# EAGLE design H_BRIDGE_40A (EAGLE 5.06)
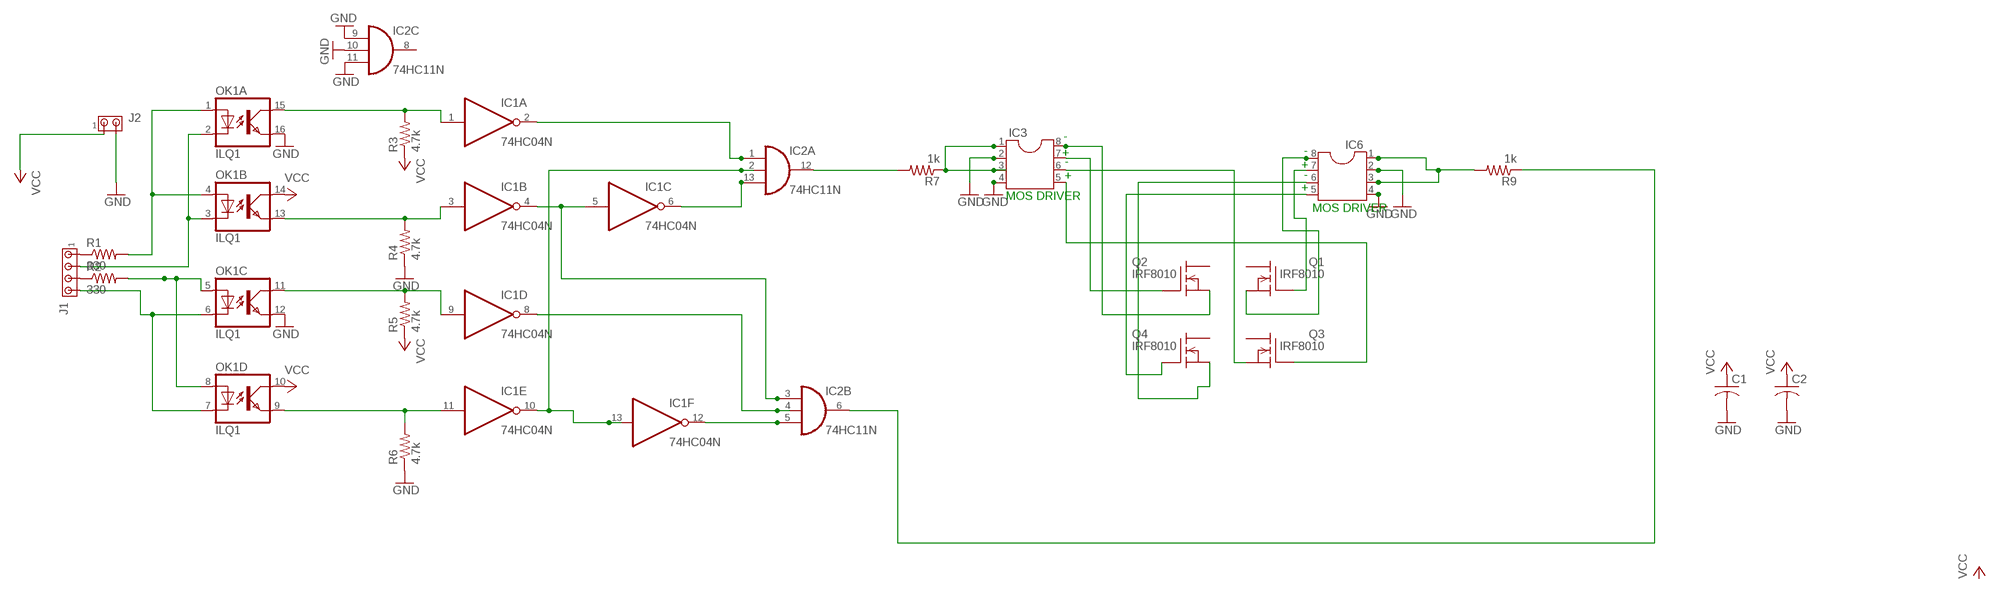
[diagram p0: schematic, sheet 1]

## Parts
C1  C-US025-030X050  [C025-030X050]
C2  C-US025-030X050  [C025-030X050]
IC1  74HC04N  [DIL14]
IC2  74HC11N  [DIL14]
IC3  DIL8  [DIL08]
IC6  DIL8  [DIL08]
J1  MTA04-100  [10X04MTA]
J2  MTA02-100  [10X02MTA]
OK1  ILQ1  [DIL16]
Q1  IRF8010  IRF840  [TO220]
Q2  IRF8010  IRF840  [TO220]
Q3  IRF8010  IRF840  [TO220]
Q4  IRF8010  IRF840  [TO220]
R1  330  R-US_0204/7  [0204/7]
R2  330  R-US_0204/7  [0204/7]
R3  4.7k  R-US_0204/7  [0204/7]
R4  4.7k  R-US_0204/7  [0204/7]
R5  4.7k  R-US_0204/7  [0204/7]
R6  4.7k  R-US_0204/7  [0204/7]
R7  1k  R-US_0204/7  [0204/7]
R9  1k  R-US_0204/7  [0204/7]

## Nets
GND: C1.2 C2.2 IC2.9(C:I0) IC2.10(C:I1) IC2.11(C:I2) IC3.2 IC3.4 IC6.2 IC6.4 J2.2 OK1.12(C:EMIT) OK1.16(A:EMIT) R4.1 R6.1
N$1: J1.1 R1.1
N$2: J1.3 R2.1
N$3: OK1.1(A:A) OK1.4(B:A) R1.2
N$4: J1.2 OK1.2(A:C) OK1.3(B:C)
N$5: OK1.5(C:A) OK1.8(D:A) R2.2
N$6: J1.4 OK1.6(C:C) OK1.7(D:C)
N$7: IC1.1(A:I) OK1.15(A:COL) R3.2
N$8: IC1.3(B:I) OK1.13(B:EMIT) R4.2
N$9: IC1.9(D:I) OK1.11(C:COL) R5.2
N$10: IC1.11(E:I) OK1.9(D:EMIT) R6.2
N$11: IC1.4(B:O) IC1.5(C:I) IC2.3(B:I0)
N$12: IC1.10(E:O) IC1.13(F:I) IC2.2(A:I1)
N$13: IC1.2(A:O) IC2.1(A:I0)
N$14: IC1.6(C:O) IC2.13(A:I2)
N$15: IC1.8(D:O) IC2.4(B:I1)
N$16: IC1.12(F:O) IC2.5(B:I2)
N$17: IC2.12(A:O) R7.2
N$18: IC2.6(B:O) R9.1
N$19: IC3.1 IC3.3 R7.1
N$21: IC6.1 IC6.3 R9.2
N$22: IC3.6 Q3.3(S)
N$23: IC6.5 Q4.1(G)
N$24: IC3.5 Q3.1(G)
N$26: IC3.7 Q2.1(G)
N$35: IC6.6 Q4.3(S)
N$36: IC6.8 Q1.3(S)
N$40: IC3.8 Q2.3(S)
N$42: IC6.7 Q1.1(G)
VCC: C1.1 C2.1 J2.1 OK1.10(D:COL) OK1.14(B:COL) R3.1 R5.1
Unconnected: IC2.8(C:O) Q1.2(D) Q2.2(D) Q3.2(D) Q4.2(D)

## Notes on the sheet
- -
- + | -
- -
- +
- + | -
- +
- MOS DRIVER
- MOS DRIVER

## Power pins joined to a net without a drawn wire
GND: IC1.7(P:GND) IC2.7(P:GND)
VCC: IC1.14(P:VCC) IC2.14(P:VCC)

## Library data of the parts
C1 C2 = rcl:C-US: CAPACITOR, American symbol
IC1 = 74xx-eu:74*04: Hex INVERTER
IC2 = 74xx-eu:74*11: Triple 3-input AND gate
IC3 IC6 = ic-package:DIL8: Dual In Line / Socket
J1 = con-amp:MTA04-100: AMP connector
J2 = con-amp:MTA02-100: AMP connector
OK1 = optocoupler:ILQ1: SIEMENS OPTO COUPLER
Q1-Q4 = transistor-fet:IRF840: N-Channel Enhancement MOSFET (HEXFET); 500V; 8A; 0,85Ohm
R1-R7 R9 = rcl:R-US_: RESISTOR, American symbol

## Board
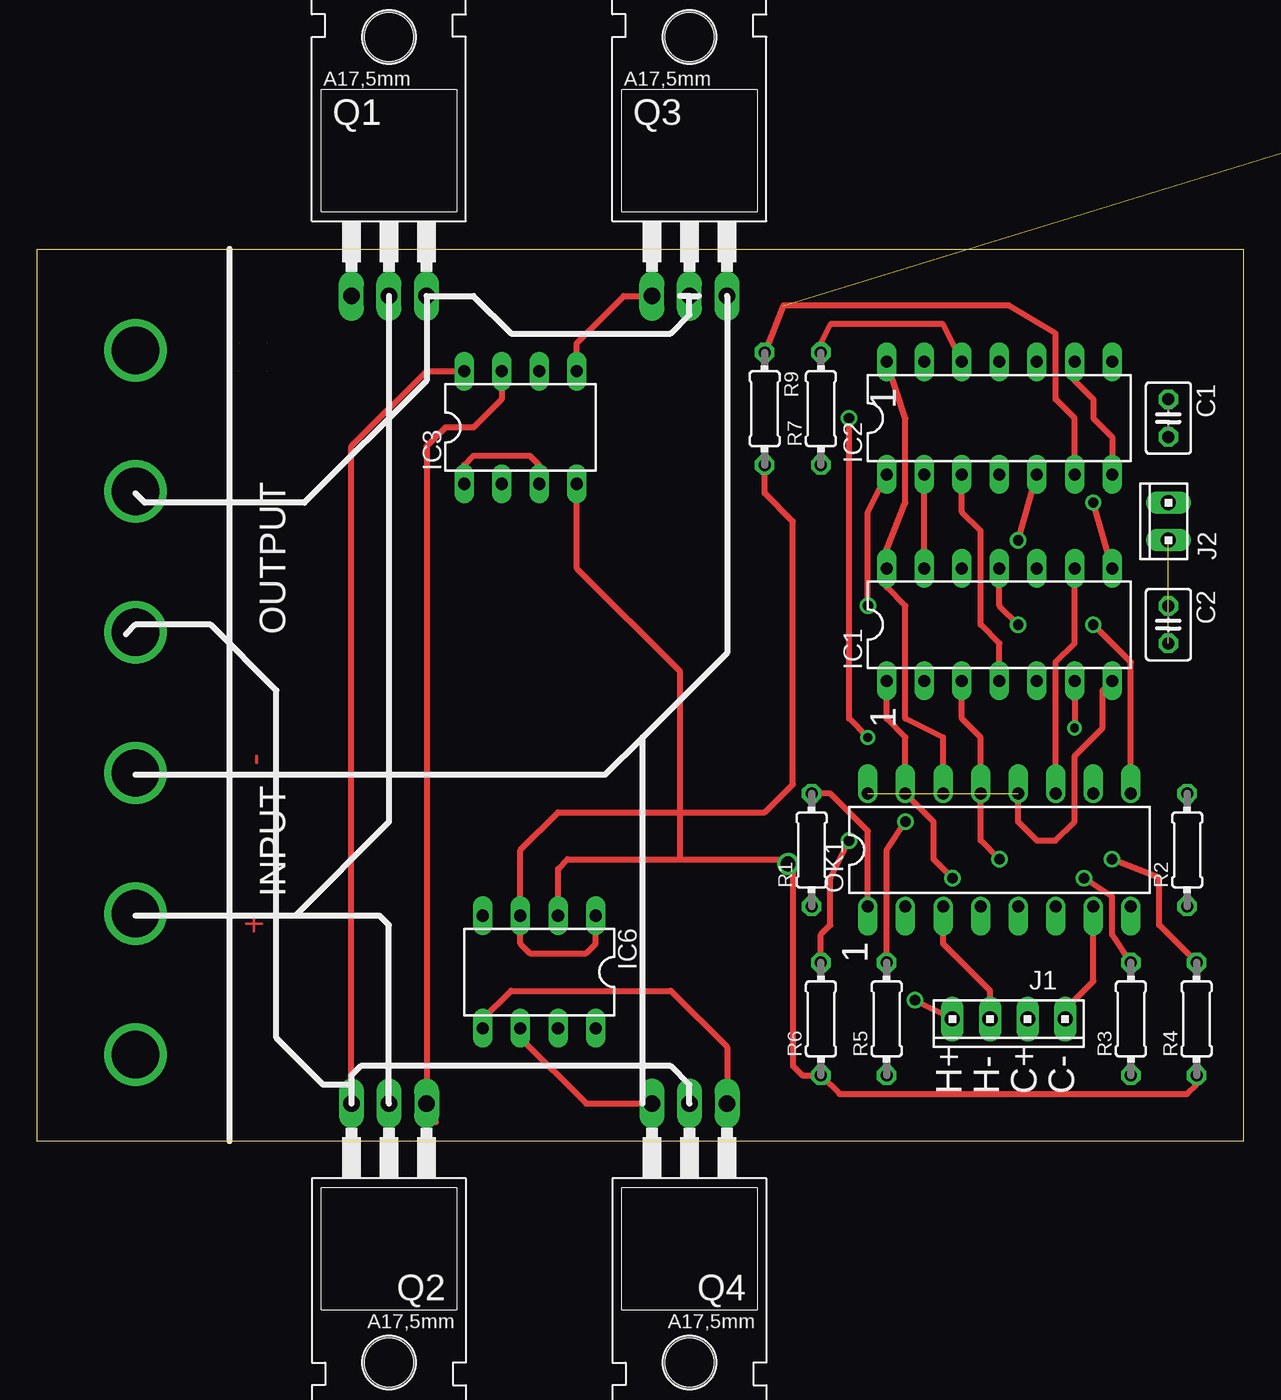
[diagram p1: board, top side]
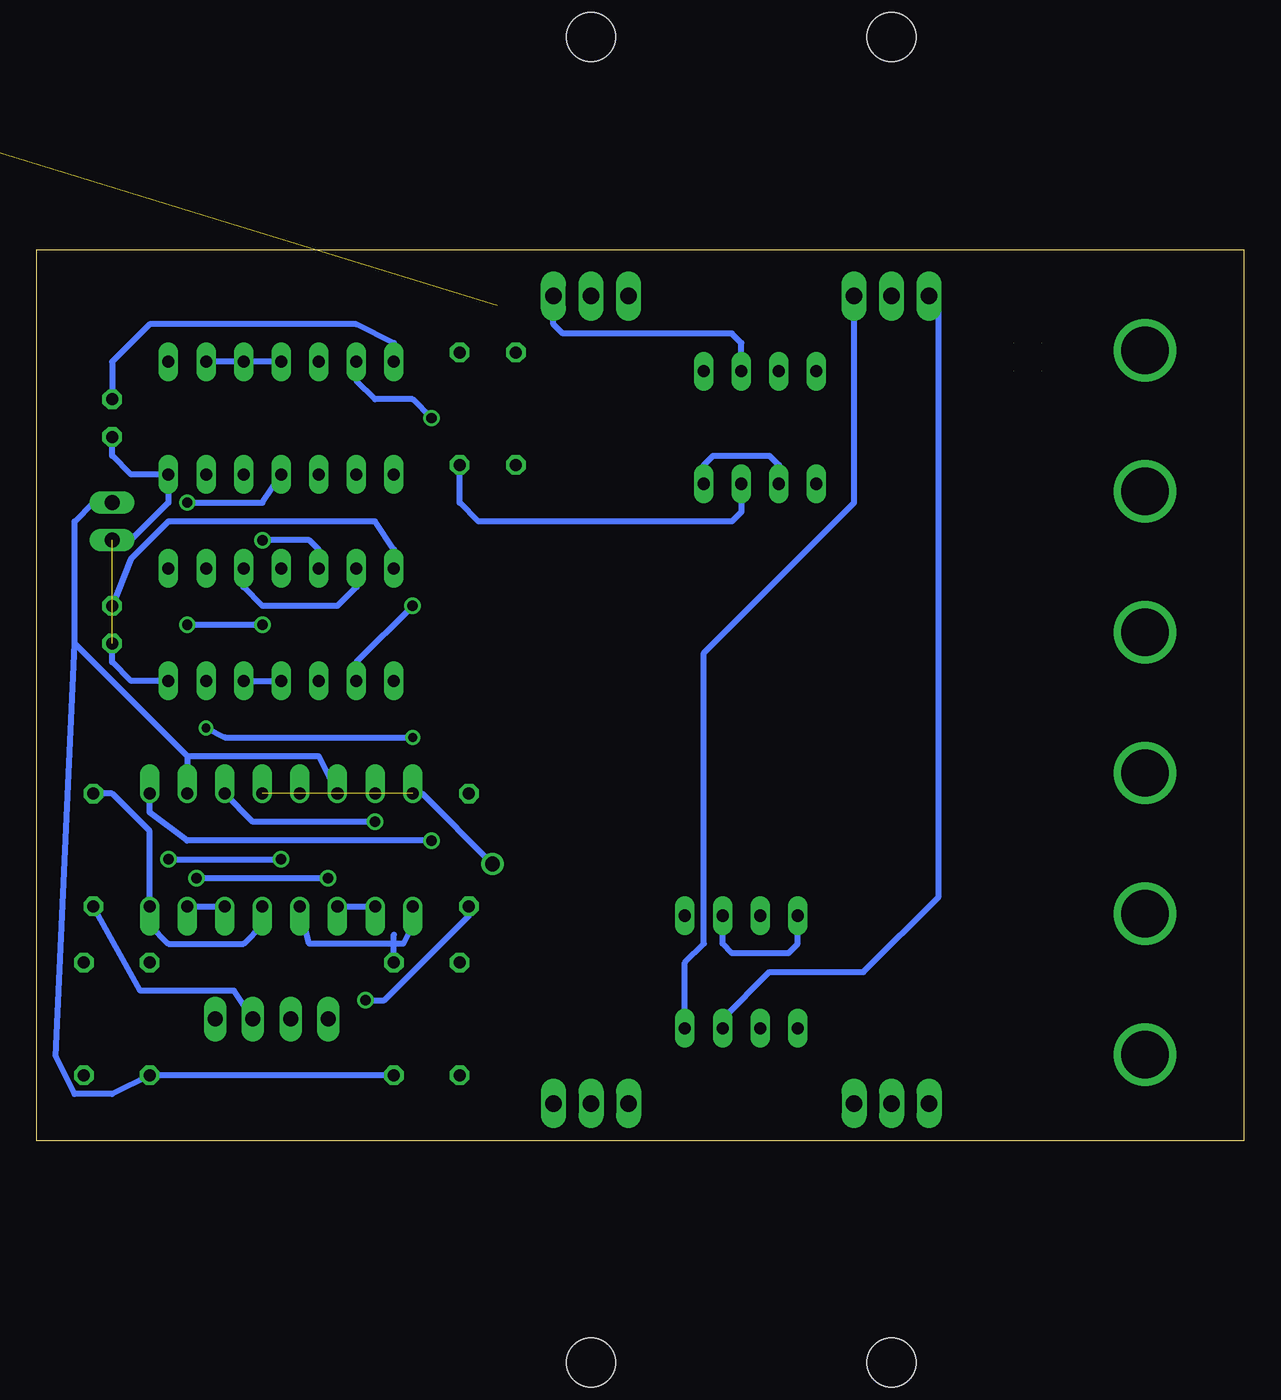
[diagram p2: board, bottom side, seen from below]

Size 81.59 x 60.3 mm. Coordinates in mm from the lower left corner, seen from the top.
Outline: 81.59,0 81.59,60.3 0,60.3 0,0 81.59,0
Copper layers (1*16): Top 0.035mm / dielectric 1.5mm / Bottom 0.035mm
Design rules "default": minimum track width 10mil, minimum drill 24mil, track to track 8mil, track to pad 8mil, pad to pad 8mil, via to via 8mil, smd to smd 8mil, copper to edge 40mil, drill to drill 8mil, minimum pad ring 10mil, minimum via ring 8mil, stop-mask expansion 4mil, vias tented up to drill 0mil, thermal gap 10mil

### Footprints (pad centres in the part's own frame; a part is rotated, then mirrored left to right if it is on the bottom)
C025-030X050 = drill 0.813 octagon: 1 -1.27,0; 2 1.27,0
DIL14 = drill 0.813 long: 1 -7.62,-3.81; 2 -5.08,-3.81; 3 -2.54,-3.81; 4 0,-3.81; 5 2.54,-3.81; 6 5.08,-3.81; 7 7.62,-3.81; 8 7.62,3.81; 9 5.08,3.81; 10 2.54,3.81; 11 0,3.81; 12 -2.54,3.81; 13 -5.08,3.81; 14 -7.62,3.81
DIL08 = drill 0.813 long: 1 -3.81,-3.81; 2 -1.27,-3.81; 3 1.27,-3.81; 4 3.81,-3.81; 5 3.81,3.81; 6 1.27,3.81; 7 -1.27,3.81; 8 -3.81,3.81
10X04MTA = drill 1.016 long: 1 3.81,0; 2 1.27,0; 3 -1.27,0; 4 -3.81,0
10X02MTA = drill 1.016 long: 1 1.27,0; 2 -1.27,0
DIL16 = drill 0.813 offset: 1 -8.89,-3.81; 2 -6.35,-3.81; 3 -3.81,-3.81; 4 -1.27,-3.81; 5 1.27,-3.81; 6 3.81,-3.81; 7 6.35,-3.81; 8 8.89,-3.81; 9 8.89,3.81; 10 6.35,3.81; 11 3.81,3.81; 12 1.27,3.81; 13 -1.27,3.81; 14 -3.81,3.81; 15 -6.35,3.81; 16 -8.89,3.81
TO220 = drill 1.118 long: 1 -2.54,-6.35; 2 0,-6.35; 3 2.54,-6.35 | hole 3.302: 0,11.176
0204/7 = drill 0.813 octagon: 1 -3.81,0; 2 3.81,0

### Placement (x,y rotation side)
C1  76.51,48.9 270 top
C2  76.51,34.92 270 top
IC1  65.08,34.92 0 top
IC2  65.08,48.9 0 top
IC3  32.69,48.26 0 top
IC6  33.96,11.43 180 top
J1  65.71,8.26 180 top
J2  76.51,41.91 90 top
OK1  65.08,19.68 0 top
Q1  23.8,63.5 0 top
Q2  23.8,-3.81 180 top
Q3  44.12,63.5 0 top
Q4  44.12,-3.81 180 top
R1  52.38,19.68 90 top
R2  77.78,19.68 90 top
R3  73.97,8.26 90 top
R4  78.41,8.26 90 top
R5  57.45,8.26 90 top
R6  53.01,8.26 90 top
R7  53.01,49.53 90 top
R9  49.2,49.53 270 top

### Tracks (layer width: path | path; a pad name or v marks a point on that pad's centre or on a via)
GND  (via drill 1)  (2 unrouted)
  Top 0.406: R4.1 78.41,3.81 77.78,3.17 54.28,3.17 R6.1 51.74,4.45 51.1,5.08 51.1,18.41 v50.79,18.73 50.47,19.05 43.48,19.05 | IC2.7 72.7,47.62 71.43,48.9 71.43,50.16 70.16,51.44 IC2.9 70.33,52.88 | OK1.12 66.35,21.59 67.62,20.32 68.89,20.32 70.16,21.59 70.16,26.04 72.06,27.94 72.06,30.48 IC1.7 | IC6.2 35.23,18.41 35.87,19.05 43.48,19.05 | IC3.4 36.5,38.73 43.48,31.75 43.48,19.05
  Bottom 0.406: IC2.9 IC2.10 IC2.11 | C2.2 76.51,32.38 75.24,31.11 IC1.7 | C1.2 76.51,46.35 75.24,45.09 IC2.7 72.7,43.18 75.24,40.64 J2.2 | v50.79,18.73 55.55,23.5 OK1.16 56.19,24.13 | IC6.2 35.23,13.34 34.59,12.7 30.79,12.7 30.15,13.34 IC6.4 | IC3.2 31.42,45.72 32.05,46.35 35.87,46.35 36.5,45.72 IC3.4
N$1  (via drill 0.7)
  Top 0.406: J1.1 v59.36,9.53
  Bottom 0.406: v59.36,9.53 58.09,9.53 52.38,15.24 R1.1
N$2
  Bottom 0.406: J1.3 68.25,10.16 74.6,10.16 R2.1
N$3
  Top 0.406: R1.2 53.65,23.5 56.19,20.95 OK1.1
  Bottom 0.406: OK1.1 56.19,14.61 56.82,13.34 63.17,13.34 OK1.4
N$4
  Top 0.406: J1.2 64.44,10.16 61.27,13.34 OK1.3
  Bottom 0.406: OK1.3 OK1.2
N$5
  Bottom 0.406: R2.2 76.51,23.5 73.97,20.95 OK1.8 73.97,14.61 72.7,13.34 67.62,13.34 66.35,14.61 OK1.5
N$6
  Top 0.406: J1.4 69.52,8.89 71.43,10.79 OK1.7
  Bottom 0.406: OK1.7 OK1.6
N$7  (via drill 0.7)
  Top 0.406: R3.2 72.7,13.97 72.7,16.51 v70.79,17.78 | v61.9,17.78 60.63,19.05 60.63,21.59 OK1.15 58.73,27.3 57.45,28.57 IC1.1
  Bottom 0.406: v70.79,17.78 v61.9,17.78
N$8  (via drill 0.7)
  Top 0.406: R4.2 75.87,14.61 75.87,17.78 v72.7,19.05 | v65.08,19.05 63.8,20.32 OK1.13 63.8,27.3 62.53,28.57 IC1.3
  Bottom 0.406: v72.7,19.05 v65.08,19.05
N$9  (via drill 0.7)  (1 unrouted)
  Top 0.406: R5.2 57.45,13.97 57.45,19.68 v58.73,21.59 | 68.89,24.77 OK1.11 68.89,32.38 70.16,33.66 IC1.9
  Bottom 0.406: v58.73,21.59 66.98,21.59 OK1.11 | R5.2 57.45,13.97
N$10  (via drill 0.7)
  Top 0.406: R6.2 53.01,13.97 53.65,14.61 53.65,17.78 v54.91,20.32 | 73.97,24.77 OK1.9 73.97,32.38 v71.43,34.92 | v66.35,34.92 65.08,36.2 IC1.11
  Bottom 0.406: v54.91,20.32 71.43,20.32 73.97,22.23 OK1.9 | v71.43,34.92 v66.35,34.92
N$11
  Top 0.406: IC1.4 65.08,33.66 63.8,34.92 63.8,41.27 62.53,42.55 IC2.3
  Bottom 0.406: IC1.5 IC1.4
N$12
  Top 0.406: IC1.13 IC2.2
  Bottom 0.406: IC1.13 59.99,37.47 61.27,36.2 66.35,36.2 67.62,37.47 IC1.10
N$13  (via drill 0.7)
  Top 0.406: v56.19,36.2 56.19,42.55 IC2.1
  Bottom 0.406: IC1.2 59.99,32.38 v56.19,36.2
N$14  (via drill 0.6, 0.7)
  Top 0.406: IC1.6 v70.16,27.94 | v56.19,27.3 54.91,28.57 v54.91,48.9
  Bottom 0.406: v70.16,27.94 68.89,27.3 v56.19,27.3 | v54.91,48.9 56.19,50.16 58.73,50.16 59.99,51.44 IC2.13
N$15  (via drill 0.7)
  Top 0.406: IC1.8 v71.43,43.18
  Bottom 0.406: v71.43,43.18 66.35,43.18 IC2.4
N$16  (via drill 0.7)
  Top 0.406: v66.35,40.64 IC2.5
  Bottom 0.406: IC1.12 62.53,40.01 63.17,40.64 v66.35,40.64
N$17
  Top 0.406: IC2.12 61.27,55.24 53.65,55.24 53.01,53.98 R7.2
N$18  (1 unrouted)
  Top 0.406: IC2.6 70.16,48.9 68.89,50.16 68.89,54.61 65.71,56.52 50.47,56.52 R9.1
N$19
  Top 0.406: IC3.1 28.88,45.72 29.52,46.35 33.33,46.35 33.96,45.72 IC3.3
  Bottom 0.406: IC3.3 33.96,42.55 34.59,41.91 51.74,41.91 53.01,43.18 R7.1
N$20  (via drill 3.2)
  other vias: 6.65,5.84
N$21
  Top 0.406: R9.2 49.2,43.81 51.1,41.91 51.1,24.13 49.2,22.23 35.23,22.23 32.69,19.68 IC6.3 32.69,13.34 33.33,12.7 37.13,12.7 37.77,13.34 IC6.1
N$22
  Bottom 0.406: IC3.6 33.96,53.98 34.59,54.61 46.02,54.61 46.66,55.24 Q3.3
N$23
  Top 0.406: IC6.5 30.15,8.26 32.05,10.16 42.85,10.16 46.66,6.35 Q4.1
N$24
  Top 0.406: IC3.5 36.5,53.98 39.67,57.15 Q3.1
N$25  (1 unrouted)
N$26
  Top 0.406: IC3.7 31.42,50.16 29.52,48.26 27.61,48.26 26.34,46.99 Q2.1 | Q2.1 26.34,1.91 26.98,1.27 26.98,1.91 Q2.1
N$27  (via drill 3.2)
  other vias: 6.65,53.47
N$28  (via drill 3.2)
  other vias: 6.65,15.37
N$29  (via drill 3.2)
  other vias: 6.65,24.89
N$30  (via drill 3.2)
  other vias: 6.65,34.42
N$31  (via drill 3.2)
  other vias: 6.65,43.94
N$35
  Top 0.406: IC6.6 32.69,6.99 37.13,2.54 Q4.3
N$36
  Bottom 0.406: IC6.8 37.77,12.06 36.5,13.34 36.5,33.02 26.34,43.18 Q1.3
N$37  (4 unrouted)
N$38  (1 unrouted)
N$40
  Top 0.406: IC3.8 26.34,52.07 21.26,46.99 Q2.3
N$42
  Bottom 0.406: IC6.7 35.23,8.26 32.05,11.43 25.7,11.43 20.62,16.51 20.62,56.52 Q1.1
VCC
  Top 0.406: OK1.14 61.27,27.3 58.73,28.57 58.73,36.2 57.45,37.47 IC1.14 57.45,40.01 58.73,43.18 58.73,48.9 IC2.14
  Bottom 0.406: R5.1 R3.1 76.51,3.17 79.05,3.17 80.32,5.71 79.05,33.66 | 79.05,33.66 71.43,26.04 | 79.05,33.66 79.05,41.91 77.78,43.18 J2.1 | 71.43,26.04 OK1.10 | 71.43,26.04 62.53,26.04 OK1.14 | IC1.14 57.45,40.01 58.73,41.91 72.7,41.91 75.24,39.37 C2.1 | C1.1 76.51,52.7 73.97,55.24 59.99,55.24 57.45,53.98 IC2.14

### Text on the board
Top: - | +
tNames: 1 | OUTPUT | 1 | INPUT | 1 | H+ | H- | C+ | C-